# Altium schematic sheet drvcomdp.SchDoc: JKA 2.0 原理图
size A4; Author: JACK; CompanyName: 北京康洁之晨水处理技术有限公司; DrawnBy: 郭相炳; Organization: 北京康洁; DocumentNumber: 6; Revision: 2.0; SheetNumber: 6; SheetTotal: 6; ImagePath: E:\JKAdoc\data\LOGO.jpg; ProjectName: JKA2.0
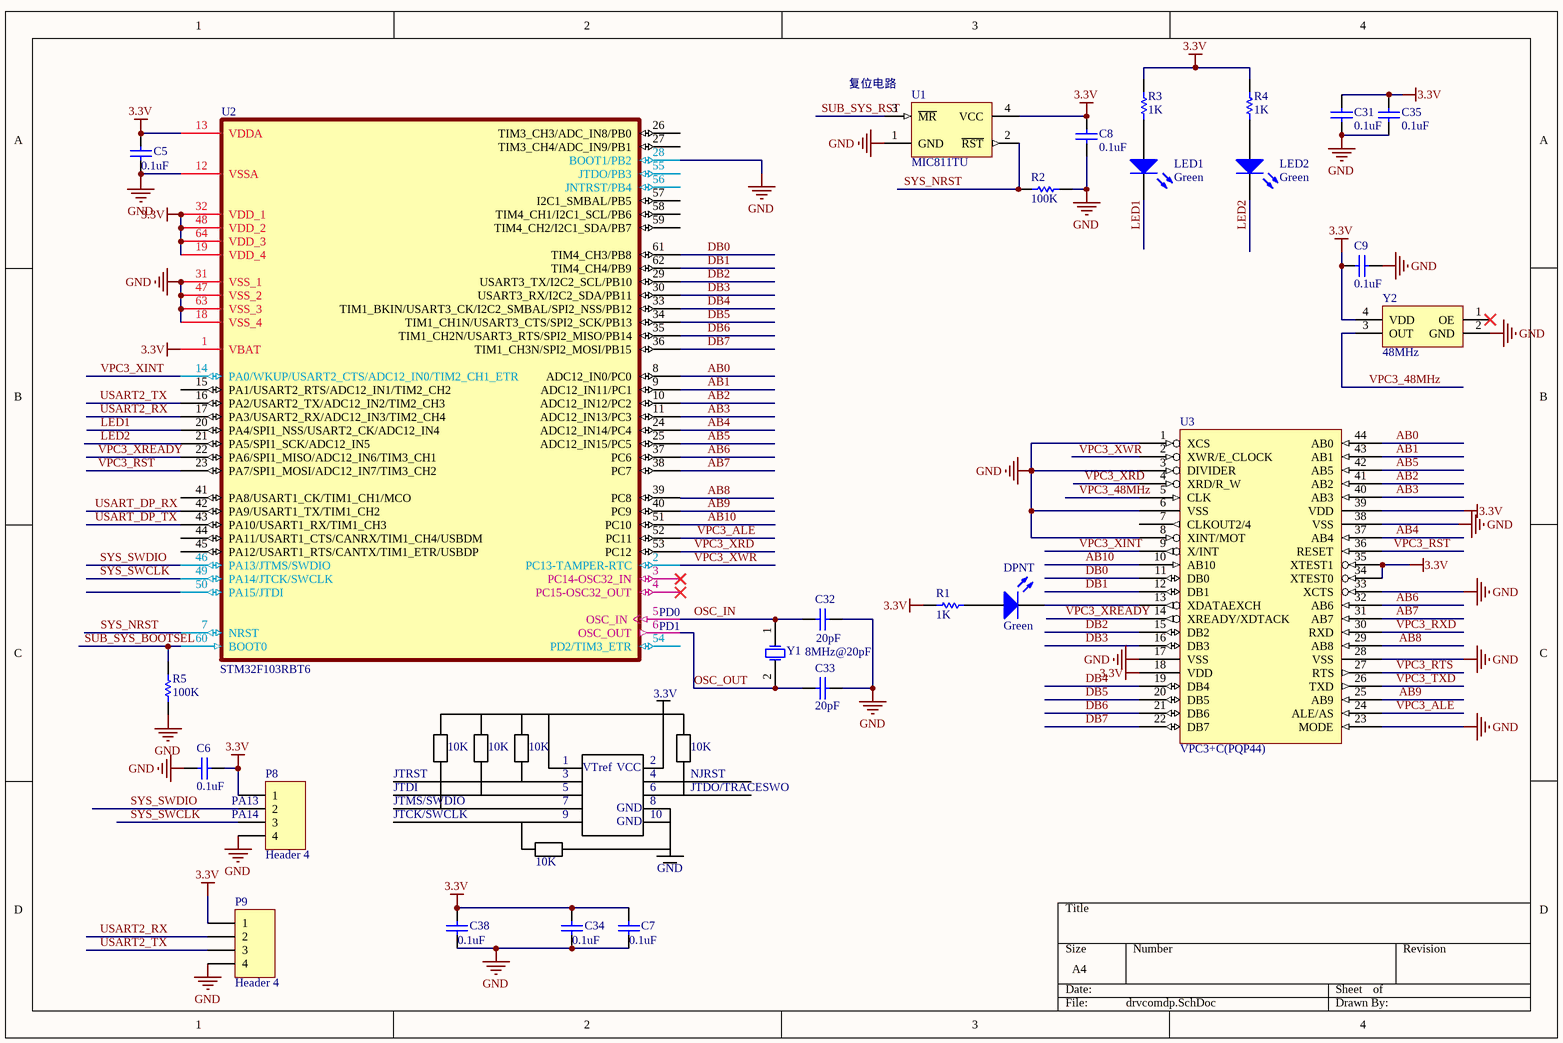
[diagram p0: drvcomdp.SchDoc]

## Parts
C5  0.1uF  [CAPC2012M]
C6  0.1uF  [CAPC2012M]
C7  0.1uF  [CAPC2012M]
C8  0.1uF  [CAPC2012M]
C9  0.1uF  [CAPC2012M]
C31  0.1uF  [CAPC2012M]
C32  20pF  [CAPC2012M]
C33  20pF  [CAPC2012M]
C34  0.1uF  [CAPC2012M]
C35  0.1uF  [CAPC2012M]
C38  0.1uF  [CAPC2012M]
DPNT  Green  [CD2012-0805]
LED1  Green  [CD2012-0805]
LED2  Green  [CD2012-0805]
P8  Header 4  [HDR1x4H-2.0]
P9  Header 4  [HDR1x4H-2.0]
R1  1K  [RESC2012M]
R2  100K  [RESC2012M]
R3  1K  [RESC2012M]
R4  1K  [RESC2012M]
R5  100K  [RESC2012M]
U1  MIC811TU  [SOT-143_N]
U2  STM32F103RBT6  [LQFP64]
U3  VPC3+C(PQP44)  [PQFP44]
Y1  8MHz@20pF  [HC-49U]
Y2  value 48MHz  [X-CP3225]  (hidden comment: XATLS)

## Nets
3.3V: C5.2 C6.2 C7.2 C8.2 C9.1 C31.1 C34.2 C35.1 C38.2 P8.1 P9.1 R1.2 R3.1 R4.1 U1.4(VCC) U2.1(VBAT) U2.13(VDDA) U2.19(VDD_4) U2.32(VDD_1) U2.48(VDD_2) U2.64(VDD_3) U3.18(VDD) U3.34(XTEST0) U3.35(XTEST1) U3.39(VDD) Y2.4(VDD)
GND: C5.1 C6.1 C7.1 C8.1 C9.2 C31.2 C32.1 C33.1 C34.1 C35.2 C38.1 P8.4 P9.4 R2.2 R5.1 U1.1(GND) U2.12(VSSA) U2.18(VSS_4) U2.28(BOOT1/PB2) U2.31(VSS_1) U2.47(VSS_2) U2.63(VSS_3) U3.1(XCS) U3.3(DIVIDER) U3.6(VSS) U3.8(XINT/MOT) U3.17(VSS) U3.23(MODE) U3.28(VSS) U3.33(XCTS) U3.38(VSS) Y2.2(GND)
AB0: U2.8(ADC12_IN0/PC0) U3.44(AB0)
AB1: U2.9(ADC12_IN11/PC1) U3.43(AB1)
AB2: U2.10(ADC12_IN12/PC2) U3.41(AB2)
AB3: U2.11(ADC12_IN13/PC3) U3.40(AB3)
AB4: U2.24(ADC12_IN14/PC4) U3.37(AB4)
AB5: U2.25(ADC12_IN15/PC5) U3.42(AB5)
AB6: U2.37(PC6) U3.32(AB6)
AB7: U2.38(PC7) U3.31(AB7)
AB8: U2.39(PC8) U3.29(AB8)
AB9: U2.40(PC9) U3.25(AB9)
AB10: U2.51(PC10) U3.10(AB10)
DB0: U2.61(TIM4_CH3/PB8) U3.11(DB0)
DB1: U2.62(TIM4_CH4/PB9) U3.12(DB1)
DB2: U2.29(USART3_TX/I2C2_SCL/PB10) U3.15(DB2)
DB3: U2.30(USART3_RX/I2C2_SDA/PB11) U3.16(DB3)
DB4: U2.33(TIM1_BKIN/USART3_CK/I2C2_SMBAL/SPI2_NSS/PB12) U3.19(DB4)
DB5: U2.34(TIM1_CH1N/USART3_CTS/SPI2_SCK/PB13) U3.20(DB5)
DB6: U2.35(TIM1_CH2N/USART3_RTS/SPI2_MISO/PB14) U3.21(DB6)
DB7: U2.36(TIM1_CH3N/SPI2_MOSI/PB15) U3.22(DB7)
LED1: LED1.2(K) U2.20(PA4/SPI1_NSS/USART2_CK/ADC12_IN4)
LED2: LED2.2(K) U2.21(PA5/SPI1_SCK/ADC12_IN5)
OSC_IN: C32.2 U2.5(OSC_IN) Y1.1(OSC1)
OSC_OUT: C33.2 U2.6(OSC_OUT) Y1.2(OSC2)
SUB_SYS_BOOTSEL: R5.2 U2.60(BOOT0)
SUB_SYS_RST: U1.3(~{MR})
SYS_NRST: R2.1 U1.2(~{RST}) U2.7(NRST)
SYS_SWCLK: P8.3 U2.49(PA14/JTCK/SWCLK)
SYS_SWDIO: P8.2 U2.46(PA13/JTMS/SWDIO)
USART2_RX: P9.2 U2.17(PA3/USART2_RX/ADC12_IN3/TIM2_CH4)
USART2_TX: P9.3 U2.16(PA2/USART2_TX/ADC12_IN2/TIM2_CH3)
USART_DP_RX: U2.42(PA9/USART1_TX/TIM1_CH2)
USART_DP_TX: U2.43(PA10/USART1_RX/TIM1_CH3)
VPC3_48MHz: U3.5(CLK) Y2.3(OUT)
VPC3_ALE: U2.52(PC11) U3.24(ALE/AS)
VPC3_RST: U2.23(PA7/SPI1_MOSI/ADC12_IN7/TIM3_CH2) U3.36(RESET)
VPC3_RTS: U3.27(RTS)
VPC3_RXD: U3.30(RXD)
VPC3_TXD: U3.26(TXD)
VPC3_XINT: U2.14(PA0/WKUP/USART2_CTS/ADC12_IN0/TIM2_CH1_ETR) U3.9(X/INT)
VPC3_XRD: U2.53(PC12) U3.4(XRD/R_W)
VPC3_XREADY: U2.22(PA6/SPI1_MISO/ADC12_IN6/TIM3_CH1) U3.14(XREADY/XDTACK)
VPC3_XWR: U2.2(PC13-TAMPER-RTC) U3.2(XWR/E_CLOCK)
NetDPNT_1: DPNT.1(A) R1.1
NetDPNT_2: DPNT.2(K) U3.13(XDATAEXCH)
NetLED1_1: LED1.1(A) R3.2
NetLED2_1: LED2.1(A) R4.2

Not connected (* = marked no-connect by the designer): U2 3(PC14-OSC32_IN)* 4(PC15-OSC32_OUT)* 15(PA1/USART2_RTS/ADC12_IN1/TIM2_CH2) 26(TIM3_CH3/ADC_IN8/PB0) 27(TIM3_CH4/ADC_IN9/PB1) 41(PA8/USART1_CK/TIM1_CH1/MCO) 44(PA11/USART1_CTS/CANRX/TIM1_CH4/USBDM) 45(PA12/USART1_RTS/CANTX/TIM1_ETR/USBDP) 50(PA15/JTDI) 54(PD2/TIM3_ETR) 55(JTDO/PB3) 56(JNTRST/PB4) 57(I2C1_SMBAL/PB5) 58(TIM4_CH1/I2C1_SCL/PB6) 59(TIM4_CH2/I2C1_SDA/PB7); U3 7(CLKOUT2/4); Y2 1(OE)*

## Notes on the sheet
- (near U1) 复位电路
- (near U2) PD1
- (near U2) PD0
- (near U2) 3.3V
- JTRST
- JTDI
- 10K
- 1
- 3
- 5
- VTref
- VCC
- 2
- 4
- 6
- NJRST
- JTDO/TRACESWO
- (near P8) PA13
- (near P8) PA14
- JTMS/SWDIO
- JTCK/SWCLK
- 7
- 9
- GND
- 8
- 10
- (near C7) GND

## Library data of the parts
C5-C9 C31 C34 C35 C38 = Cap: Capacitor; Value: 1nF; Published: 8-Jun-2000; LatestRevisionDate: 17-Jul-2002; LatestRevisionNote: Re-released for DXP Platform.; PackageReference: RAD-0.3; Publisher: Altium Limited
C32 C33 = Cap: Capacitor; Value: 100pF; Published: 8-Jun-2000; LatestRevisionDate: 17-Jul-2002; LatestRevisionNote: Re-released for DXP Platform.; PackageReference: RAD-0.3; Publisher: Altium Limited
DPNT LED1 LED2 = LED1: Green LED,Output indicate.; Published: 8-Jun-2000; LatestRevisionDate: 08-Jul-2005; LatestRevisionNote: Mech Layer 1 removed.; PackageReference: LED-1; Publisher: Altium Limited
P8 P9 = Header 4: Header, 4-Pin; LatestRevisionDate: 17-Jul-2002; LatestRevisionNote: Re-released for DXP Platform.; Publisher: Altium Limited
R1-R5 = Res1: Resistor; Value: 10K; Published: 8-Jun-2000; LatestRevisionDate: 17-Jul-2002; LatestRevisionNote: Re-released for DXP Platform.; PackageReference: AXIAL-0.3; Publisher: Altium Limited
U1 = MAX811-EUS-T: 4-Pin 礟 Voltage Monitors with Manual Reset Input; Published: 16-Jan-2001; LatestRevisionDate: 29-May-2009; LatestRevisionNote: IPC-7351 Footprint Added.; DatasheetVersion: Feb-1998; PackageVersion: Feb-1998; PackageReference: SOT143; Publisher: Altium Limited; PackageDescription: 4-Pin SOT-143 Package 1.9 mm Pitch, 2.3 mm Lead Span; ComponentLink1Description: Manufacturer Link; ComponentLink1URL: http://www.maxim-ic.com/; ComponentLink2Description: Datasheet; ComponentLink2URL: http://pdfserv.maxim-ic.com/en/ds/MAX811-MAX812.pdf
U2 = STM32F103RBT6: STM32 ARM-based 32-bit MCU with 128 Kbytes Flash, 64-pin LQFP, Industrial Temperature; Published: *; DatasheetVersion: *; PackageVersion: *; PackageReference: *; Publisher: *; PackageDescription: *; ComponentLink1Description: *; ComponentLink1URL: *; ComponentLink2Description: *; ComponentLink2URL: *
U3 = VPC3+C(PQP44): a communication chip with processor interface for  intelligent PROFIBUS DP-Slave applications
Y1 = XTAL: Crystal Oscillator; Published: 8-Jun-2000; LatestRevisionDate: 17-Jul-2002; LatestRevisionNote: Re-released for DXP Platform.; PackageReference: R38; Publisher: Altium Limited
Y2 = XATLS: 贴片有源晶振